# Altium schematic sheet STM32MP25XXAK._2_DDR3L_Project_Overview.SchDoc: Project overview
size A4; Date: Not used; ApprovedBy: Not used; CheckedBy: Not used; Author: Not used; CompanyName: STMicroelectronics; DrawnBy: Not used; Engineer: Not used; Organization: Not used; Address1: Not used; Address2: Not used; Address3: Not used; Address4: Not used; DocumentNumber: Not used; Revision: Not used; SheetNumber: 1; SheetTotal: 7; CurrentTime: Not used; CurrentDate: Not used; Time: Not used; DocumentFullPathAndName: Not used; DocumentName: Not used; ModifiedDate: Not used; ImagePath: Not used; ProjectName: Not used; Application_BuildNumber: Not used
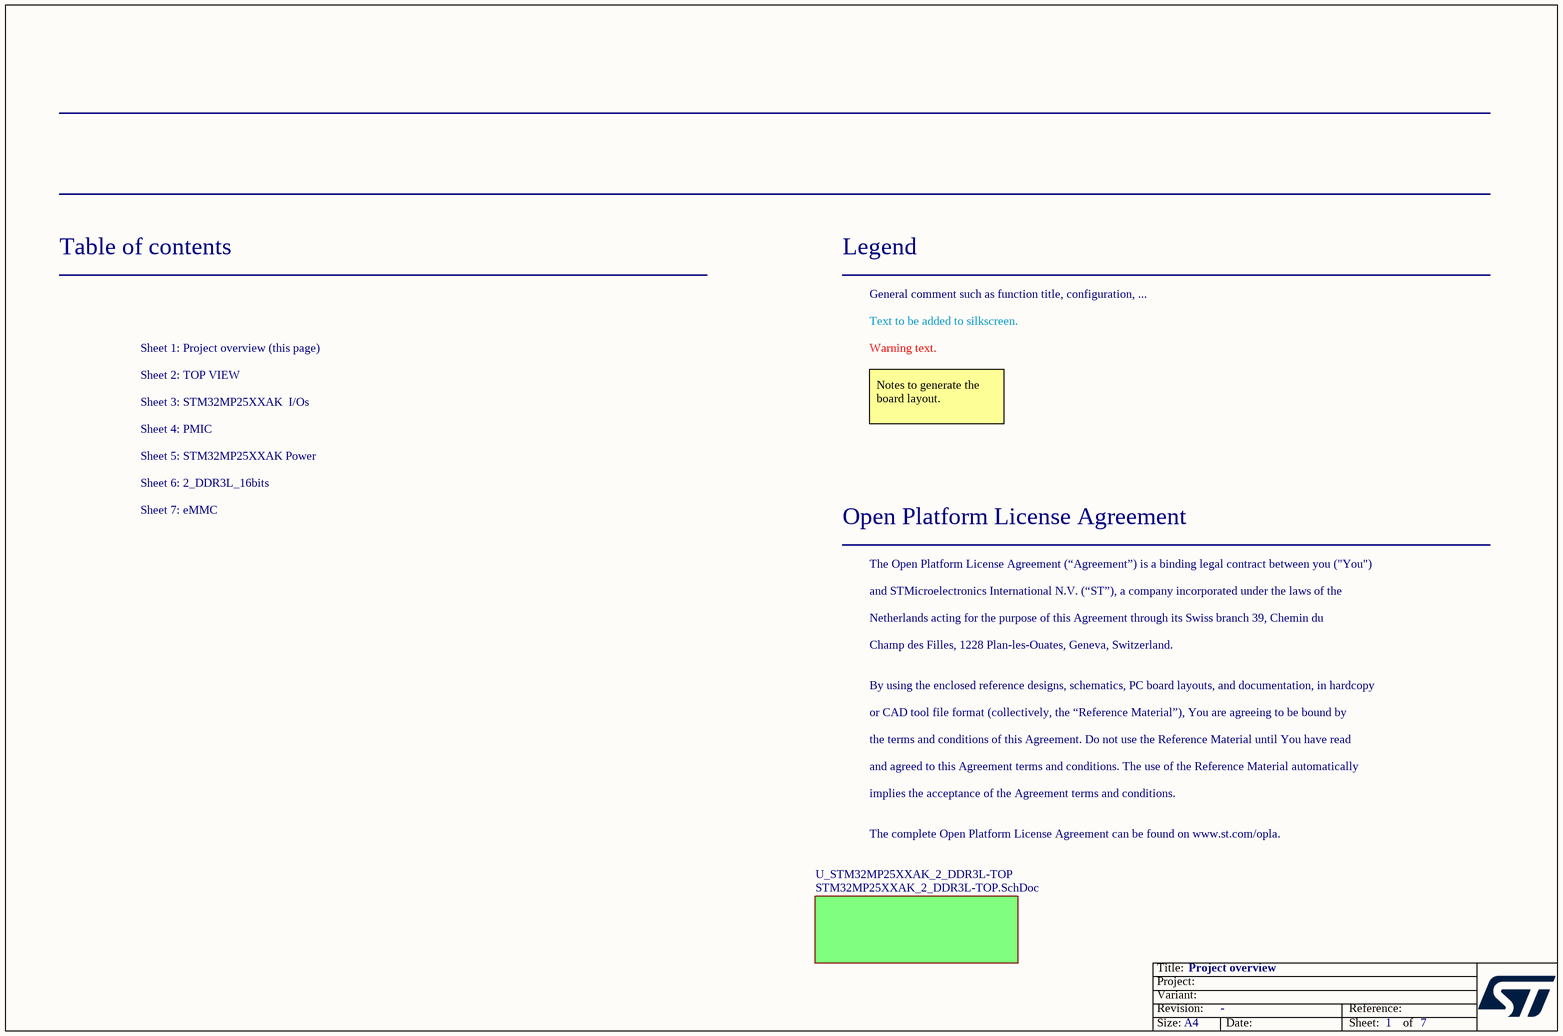
[diagram p0: STM32MP25XXAK._2_DDR3L_Project_Overview.SchDoc]

## Sub-sheets
U_STM32MP25XXAK_2_DDR3L-TOP = STM32MP25XXAK_2_DDR3L-TOP.SchDoc: no entries

## Notes on the sheet
- Table of contents
- Legend
- General comment such as function title, configuration, ...
- Sheet 1: Project overview (this page)
- Sheet 2: TOP VIEW
- Text to be added to silkscreen.
- Warning text.
- Sheet 3: STM32MP25XXAK  I/Os
- Sheet 4: PMIC
- Notes to generate the board layout.
- Sheet 5: STM32MP25XXAK Power
- Sheet 7: eMMC
- Sheet 6: 2_DDR3L_16bits
- Open Platform License Agreement
- The Open Platform License Agreement (“Agreement”) is a binding legal contract between you ("You")
- and STMicroelectronics International N.V. (“ST”), a company incorporated under the laws of the
- Netherlands acting for the purpose of this Agreement through its Swiss branch 39, Chemin du
- Champ des Filles, 1228 Plan-les-Ouates, Geneva, Switzerland.
- By using the enclosed reference designs, schematics, PC board layouts, and documentation, in hardcopy
- or CAD tool file format (collectively, the “Reference Material”), You are agreeing to be bound by
- the terms and conditions of this Agreement. Do not use the Reference Material until You have read
- and agreed to this Agreement terms and conditions. The use of the Reference Material automatically
- implies the acceptance of the Agreement terms and conditions.
- The complete Open Platform License Agreement can be found on www.st.com/opla.
- Title:
- Project:
- Size:
- Revision:
- Variant:
- A4
- -
- Date:
- Reference:
- Sheet:
- of